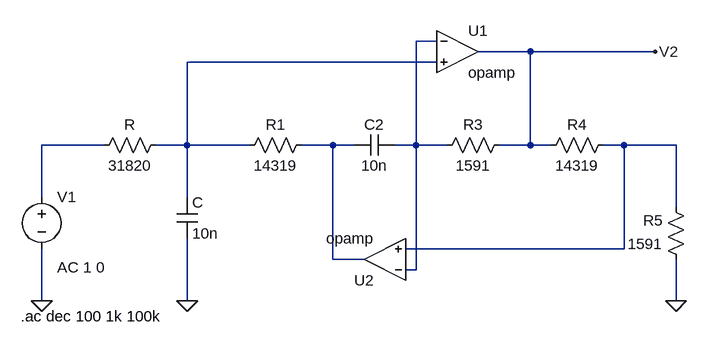
[diagram p0: schematic TS1.asc]
TS1.asc, the LTspice schematic file:
Version 4
SHEET 1 980 680
WIRE 592 -64 560 -64
WIRE 736 -48 656 -48
WIRE 928 -48 736 -48
WIRE 592 -32 208 -32
WIRE 80 96 -16 96
WIRE 208 96 208 -32
WIRE 208 96 160 96
WIRE 304 96 208 96
WIRE 432 96 384 96
WIRE 464 96 432 96
WIRE 560 96 560 -64
WIRE 560 96 528 96
WIRE 608 96 560 96
WIRE 736 96 736 -48
WIRE 736 96 688 96
WIRE 768 96 736 96
WIRE 880 96 848 96
WIRE 960 96 880 96
WIRE -16 176 -16 96
WIRE 208 176 208 96
WIRE 960 192 960 96
WIRE 880 256 880 96
WIRE 880 256 544 256
WIRE 432 272 432 96
WIRE 480 272 432 272
WIRE 560 288 560 96
WIRE 560 288 544 288
WIRE -16 336 -16 256
WIRE 208 336 208 240
WIRE 960 336 960 272
FLAG -16 336 0
FLAG 208 336 0
FLAG 960 336 0
FLAG 928 -48 V2
SYMBOL voltage -16 160 R0
WINDOW 123 24 124 Left 2
WINDOW 39 0 0 Left 0
SYMATTR Value2 AC 1 0
SYMATTR InstName V1
SYMATTR Value ""
SYMBOL res 400 80 R90
WINDOW 0 0 56 VBottom 2
WINDOW 3 32 56 VTop 2
SYMATTR InstName R1
SYMATTR Value 14319
SYMBOL res 176 80 R90
WINDOW 0 0 56 VBottom 2
WINDOW 3 32 56 VTop 2
SYMATTR InstName R
SYMATTR Value 31820
SYMBOL res 704 80 R90
WINDOW 0 0 56 VBottom 2
WINDOW 3 32 56 VTop 2
SYMATTR InstName R3
SYMATTR Value 1591
SYMBOL res 864 80 R90
WINDOW 0 0 56 VBottom 2
WINDOW 3 32 56 VTop 2
SYMATTR InstName R4
SYMATTR Value 14319
SYMBOL res 976 288 R180
WINDOW 0 36 76 Left 2
WINDOW 3 36 40 Left 2
SYMATTR InstName R5
SYMATTR Value 1591
SYMBOL cap 192 176 R0
SYMATTR InstName C
SYMATTR Value 10n
SYMBOL cap 528 80 R90
WINDOW 0 0 32 VBottom 2
WINDOW 3 32 32 VTop 2
SYMATTR InstName C2
SYMATTR Value 10n
SYMBOL opamp 624 -112 R0
SYMATTR InstName U1
SYMBOL opamp 512 336 R180
SYMATTR InstName U2
TEXT -48 360 Left 2 !.ac dec 100 1k 100k

The netlist it stands for:
* TS1.asc
V1 N003 0 AC 1 0
R1 N004 N002 14319
R N002 N003 31820
R3 V2 N001 1591
R4 N005 V2 14319
R5 0 N005 1591
C N002 0 10n
C2 N001 N004 10n
XU1 N001 N002 V2 opamp Aol=100K GBW=10Meg  ; pins invin noninvin out
XU2 N001 N005 N004 opamp Aol=100K GBW=10Meg  ; pins invin noninvin out
.ac dec 100 1k 100k
.backanno
.end